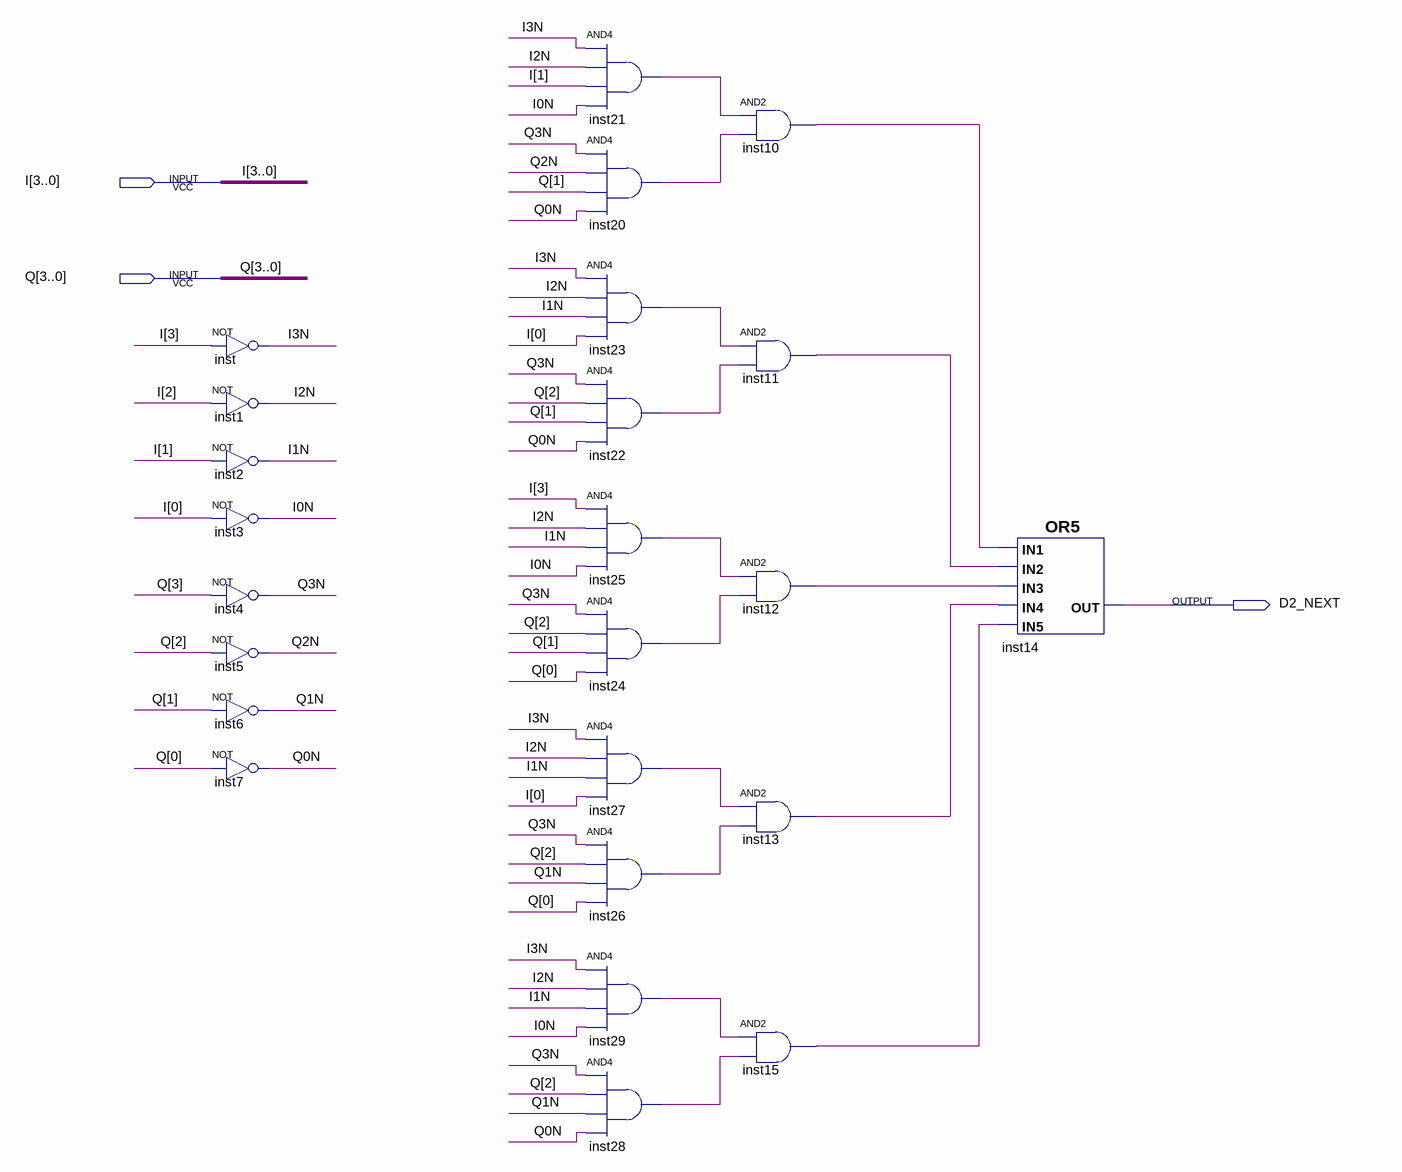
[diagram p0: schematic sheet]
// Quartus schematic D2_GEN.bdf as structural Verilog: 24 symbols, 3 pins
module D2_GEN (
  input  [3:0] I,
  input  [3:0] Q,
  output D2_NEXT
);

  wire I0N, I1N, I2N, I3N, inst10_out, inst11_out, inst12_out, inst13_out, inst15_out, inst20_out,
       inst21_out, inst22_out, inst23_out, inst24_out, inst25_out, inst26_out, inst27_out, inst28_out,
       inst29_out, Q0N, Q1N, Q2N, Q3N;

  not inst (I3N, I[3]);
  not inst1 (I2N, I[2]);
  not inst2 (I1N, I[1]);
  not inst3 (I0N, I[0]);
  not inst4 (Q3N, Q[3]);
  not inst5 (Q2N, Q[2]);
  not inst6 (Q1N, Q[1]);
  not inst7 (Q0N, Q[0]);
  and inst21 (inst21_out, I3N, I2N, I[1], I0N);
  and inst20 (inst20_out, Q3N, Q2N, Q[1], Q0N);
  and inst23 (inst23_out, I3N, I2N, I1N, I[0]);
  and inst22 (inst22_out, Q3N, Q[2], Q[1], Q0N);
  and inst25 (inst25_out, I[3], I2N, I1N, I0N);
  and inst24 (inst24_out, Q3N, Q[2], Q[1], Q[0]);
  and inst27 (inst27_out, I3N, I2N, I1N, I[0]);
  and inst26 (inst26_out, Q3N, Q[2], Q1N, Q[0]);
  and inst29 (inst29_out, I3N, I2N, I1N, I0N);
  and inst28 (inst28_out, Q3N, Q[2], Q1N, Q0N);
  and inst10 (inst10_out, inst21_out, inst20_out);
  and inst11 (inst11_out, inst23_out, inst22_out);
  and inst12 (inst12_out, inst25_out, inst24_out);
  and inst13 (inst13_out, inst27_out, inst26_out);
  and inst15 (inst15_out, inst29_out, inst28_out);
  or inst14 (D2_NEXT, inst10_out, inst11_out, inst12_out, inst13_out, inst15_out);
endmodule
